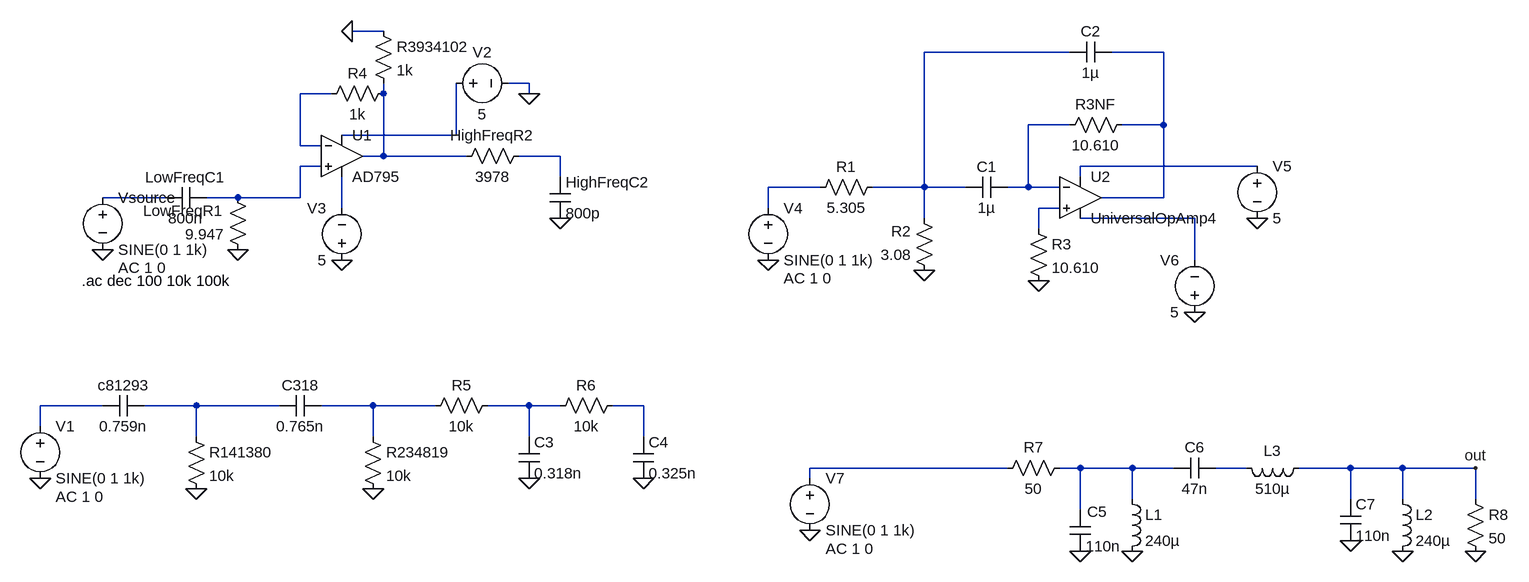
[diagram p0: schematic RLC_active_bandpassfilter.asc]
RLC_active_bandpassfilter.asc, the LTspice schematic file:
Version 4
SHEET 1 1880 800
WIRE 144 -160 96 -160
WIRE 1200 -128 976 -128
WIRE 1344 -128 1264 -128
WIRE 368 -80 336 -80
WIRE 64 -64 16 -64
WIRE 144 -64 144 -80
WIRE 368 -64 368 -80
WIRE 1200 -16 1136 -16
WIRE 1344 -16 1344 -128
WIRE 1344 -16 1280 -16
WIRE 256 0 256 -80
WIRE 256 0 80 0
WIRE 16 16 16 -64
WIRE 48 16 16 16
WIRE 144 32 144 -64
WIRE 144 32 112 32
WIRE 272 32 144 32
WIRE 416 32 352 32
WIRE 48 48 16 48
WIRE 1488 48 1216 48
WIRE 416 64 416 32
WIRE 1216 64 1216 48
WIRE 816 80 736 80
WIRE 976 80 976 -128
WIRE 976 80 896 80
WIRE 1040 80 976 80
WIRE 1136 80 1136 -16
WIRE 1136 80 1104 80
WIRE 1184 80 1136 80
WIRE -192 96 -288 96
WIRE -80 96 -128 96
WIRE 16 96 16 48
WIRE 16 96 -80 96
WIRE 1344 96 1344 -16
WIRE 1344 96 1248 96
WIRE 80 112 80 64
WIRE 736 112 736 80
WIRE 1184 112 1152 112
WIRE 976 128 976 80
WIRE 1392 128 1216 128
WIRE 1152 144 1152 112
WIRE 1392 192 1392 128
WIRE -288 416 -384 416
WIRE -144 416 -224 416
WIRE -16 416 -144 416
WIRE 128 416 48 416
WIRE 224 416 128 416
WIRE 368 416 304 416
WIRE 416 416 368 416
WIRE 544 416 496 416
WIRE -384 448 -384 416
WIRE -144 464 -144 416
WIRE 128 464 128 416
WIRE 368 464 368 416
WIRE 544 464 544 416
WIRE 1104 512 800 512
WIRE 1216 512 1184 512
WIRE 1296 512 1216 512
WIRE 1360 512 1296 512
WIRE 1472 512 1424 512
WIRE 1632 512 1552 512
WIRE 1712 512 1632 512
WIRE 1824 512 1712 512
WIRE 800 528 800 512
WIRE 1296 560 1296 512
WIRE 1632 560 1632 512
WIRE 1712 560 1712 512
WIRE 1824 560 1824 512
WIRE 1216 576 1216 512
FLAG 416 128 0
FLAG -80 176 0
FLAG 96 -160 0
FLAG -288 176 0
FLAG 80 192 0
FLAG 368 -64 0
FLAG -384 528 0
FLAG -144 544 0
FLAG 128 544 0
FLAG 368 528 0
FLAG 544 528 0
FLAG 736 192 0
FLAG 976 208 0
FLAG 1152 224 0
FLAG 1488 128 0
FLAG 1392 272 0
FLAG 1216 640 0
FLAG 1296 640 0
FLAG 1632 624 0
FLAG 1712 640 0
FLAG 1824 640 0
FLAG 1824 512 out
FLAG 800 608 0
SYMBOL res -64 192 R180
WINDOW 0 36 76 Left 2
WINDOW 3 36 40 Left 2
SYMATTR InstName LowFreqR1
SYMATTR Value 9.947
SYMBOL res 368 16 R90
WINDOW 0 0 56 VBottom 2
WINDOW 3 32 56 VTop 2
SYMATTR InstName HighFreqR2
SYMATTR Value 3978
SYMBOL res 128 -176 R0
SYMATTR InstName R3934102
SYMATTR Value 1k
SYMBOL res 160 -80 R90
WINDOW 0 0 56 VBottom 2
WINDOW 3 32 56 VTop 2
SYMATTR InstName R4
SYMATTR Value 1k
SYMBOL cap -128 80 R90
WINDOW 0 0 32 VBottom 2
WINDOW 3 32 32 VTop 2
SYMATTR InstName LowFreqC1
SYMATTR Value 800n
SYMBOL cap 400 64 R0
SYMATTR InstName HighFreqC2
SYMATTR Value 800p
SYMBOL OpAmps\\AD795 80 -32 R0
SYMATTR InstName U1
SYMBOL voltage -288 80 R0
WINDOW 123 24 124 Left 2
WINDOW 39 0 0 Left 0
SYMATTR Value2 AC 1 0
SYMATTR InstName Vsource
SYMATTR Value SINE(0 1 1k)
SYMBOL voltage 240 -80 R270
WINDOW 0 32 56 VTop 2
WINDOW 3 -32 56 VBottom 2
WINDOW 123 0 0 Left 0
WINDOW 39 0 0 Left 0
SYMATTR InstName V2
SYMATTR Value 5
SYMBOL voltage 80 208 R180
WINDOW 0 24 96 Left 2
WINDOW 3 24 16 Left 2
WINDOW 123 0 0 Left 0
WINDOW 39 0 0 Left 0
SYMATTR InstName V3
SYMATTR Value 5
SYMBOL voltage -384 432 R0
WINDOW 123 24 124 Left 2
WINDOW 39 0 0 Left 0
SYMATTR Value2 AC 1 0
SYMATTR InstName V1
SYMATTR Value SINE(0 1 1k)
SYMBOL res -160 448 R0
SYMATTR InstName R141380
SYMATTR Value 10k
SYMBOL cap -224 400 R90
WINDOW 0 0 32 VBottom 2
WINDOW 3 32 32 VTop 2
SYMATTR InstName c81293
SYMATTR Value 0.759n
SYMBOL cap 48 400 R90
WINDOW 0 0 32 VBottom 2
WINDOW 3 32 32 VTop 2
SYMATTR InstName C318
SYMATTR Value 0.765n
SYMBOL res 112 448 R0
SYMATTR InstName R234819
SYMATTR Value 10k
SYMBOL cap 352 464 R0
SYMATTR InstName C3
SYMATTR Value 0.318n
SYMBOL cap 528 464 R0
SYMATTR InstName C4
SYMATTR Value 0.325n
SYMBOL res 320 400 R90
WINDOW 0 0 56 VBottom 2
WINDOW 3 32 56 VTop 2
SYMATTR InstName R5
SYMATTR Value 10k
SYMBOL res 512 400 R90
WINDOW 0 0 56 VBottom 2
WINDOW 3 32 56 VTop 2
SYMATTR InstName R6
SYMATTR Value 10k
SYMBOL voltage 736 96 R0
WINDOW 123 24 124 Left 2
WINDOW 39 0 0 Left 0
SYMATTR Value2 AC 1 0
SYMATTR InstName V4
SYMATTR Value SINE(0 1 1k)
SYMBOL res 912 64 R90
WINDOW 0 0 56 VBottom 2
WINDOW 3 32 56 VTop 2
SYMATTR InstName R1
SYMATTR Value 5.305
SYMBOL res 992 224 R180
WINDOW 0 36 76 Left 2
WINDOW 3 36 40 Left 2
SYMATTR InstName R2
SYMATTR Value 3.08
SYMBOL cap 1104 64 R90
WINDOW 0 0 32 VBottom 2
WINDOW 3 32 32 VTop 2
SYMATTR InstName C1
SYMATTR Value 1µ
SYMBOL OpAmps\\UniversalOpAmp4 1216 96 R0
SYMATTR InstName U2
SYMBOL res 1136 128 R0
SYMATTR InstName R3
SYMATTR Value 10.610
SYMBOL res 1296 -32 R90
WINDOW 0 0 56 VBottom 2
WINDOW 3 32 56 VTop 2
SYMATTR InstName R3NF
SYMATTR Value 10.610
SYMBOL cap 1200 -112 R270
WINDOW 0 32 32 VTop 2
WINDOW 3 0 32 VBottom 2
SYMATTR InstName C2
SYMATTR Value 1µ
SYMBOL voltage 1488 32 R0
WINDOW 123 0 0 Left 0
WINDOW 39 0 0 Left 0
SYMATTR InstName V5
SYMATTR Value 5
SYMBOL voltage 1392 288 R180
WINDOW 0 24 96 Left 2
WINDOW 3 24 16 Left 2
WINDOW 123 0 0 Left 0
WINDOW 39 0 0 Left 0
SYMATTR InstName V6
SYMATTR Value 5
SYMBOL ind 1280 544 R0
SYMATTR InstName L1
SYMATTR Value 240µ
SYMBOL ind 1696 544 R0
SYMATTR InstName L2
SYMATTR Value 240µ
SYMBOL ind 1568 496 R90
WINDOW 0 5 56 VBottom 2
WINDOW 3 32 56 VTop 2
SYMATTR InstName L3
SYMATTR Value 510µ
SYMBOL cap 1200 576 R0
WINDOW 0 27 3 Left 2
SYMATTR InstName C5
SYMATTR Value 110n
SYMBOL cap 1424 496 R90
WINDOW 0 0 32 VBottom 2
WINDOW 3 32 32 VTop 2
SYMATTR InstName C6
SYMATTR Value 47n
SYMBOL cap 1616 560 R0
SYMATTR InstName C7
SYMATTR Value 110n
SYMBOL res 1200 496 R90
WINDOW 0 0 56 VBottom 2
WINDOW 3 32 56 VTop 2
SYMATTR InstName R7
SYMATTR Value 50
SYMBOL res 1808 544 R0
SYMATTR InstName R8
SYMATTR Value 50
SYMBOL voltage 800 512 R0
WINDOW 123 24 124 Left 2
WINDOW 39 0 0 Left 0
SYMATTR Value2 AC 1 0
SYMATTR InstName V7
SYMATTR Value SINE(0 1 1k)
TEXT -320 224 Left 2 !.ac dec 100 10k 100k

The netlist it stands for:
* RLC_active_bandpassfilter.asc
R§LowFreqR1 0 N008 9.947
R§HighFreqR2 N007 N004 3978
R3934102 0 N004 1k
R4 N004 N003 1k
C§LowFreqC1 N008 N011 800n
C§HighFreqC2 N007 0 800p
XU1 N008 N003 N006 N012 N004 AD795  ; pins In+ In- V+ V- OUT
Vsource N011 0 SINE(0 1 1k) AC 1 0
V2 N006 0 5
V3 0 N012 5
V1 N015 0 SINE(0 1 1k) AC 1 0
R141380 N016 0 10k
c81293 N016 N015 0.759n
C318 N017 N016 0.765n
R234819 N017 0 10k
C3 N018 0 0.318n
C4 N019 0 0.325n
R5 N018 N017 10k
R6 N019 N018 10k
V4 N010 0 SINE(0 1 1k) AC 1 0
R1 N001 N010 5.305
R2 0 N001 3.08
C1 N005 N001 1µ
* U2: UniversalOpAmp4 (symbol OpAmps\UniversalOpAmp4 not available, pins judged from their places): In+=N013 In-=N005 V+=N009 V-=N014 OUT=N002
R3 N013 0 10.610
R3NF N002 N005 10.610
C2 N001 N002 1µ
V5 N009 0 5
V6 0 N014 5
L1 N021 0 240µ
L2 out 0 240µ
L3 out N022 510µ
C5 N021 0 110n
C6 N022 N021 47n
C7 out 0 110n
R7 N021 N020 50
R8 out 0 50
V7 N020 0 SINE(0 1 1k) AC 1 0
.ac dec 100 10k 100k
.lib ADI1.lib
.backanno
.end